# Altium schematic sheet led_board.SchDoc
size A
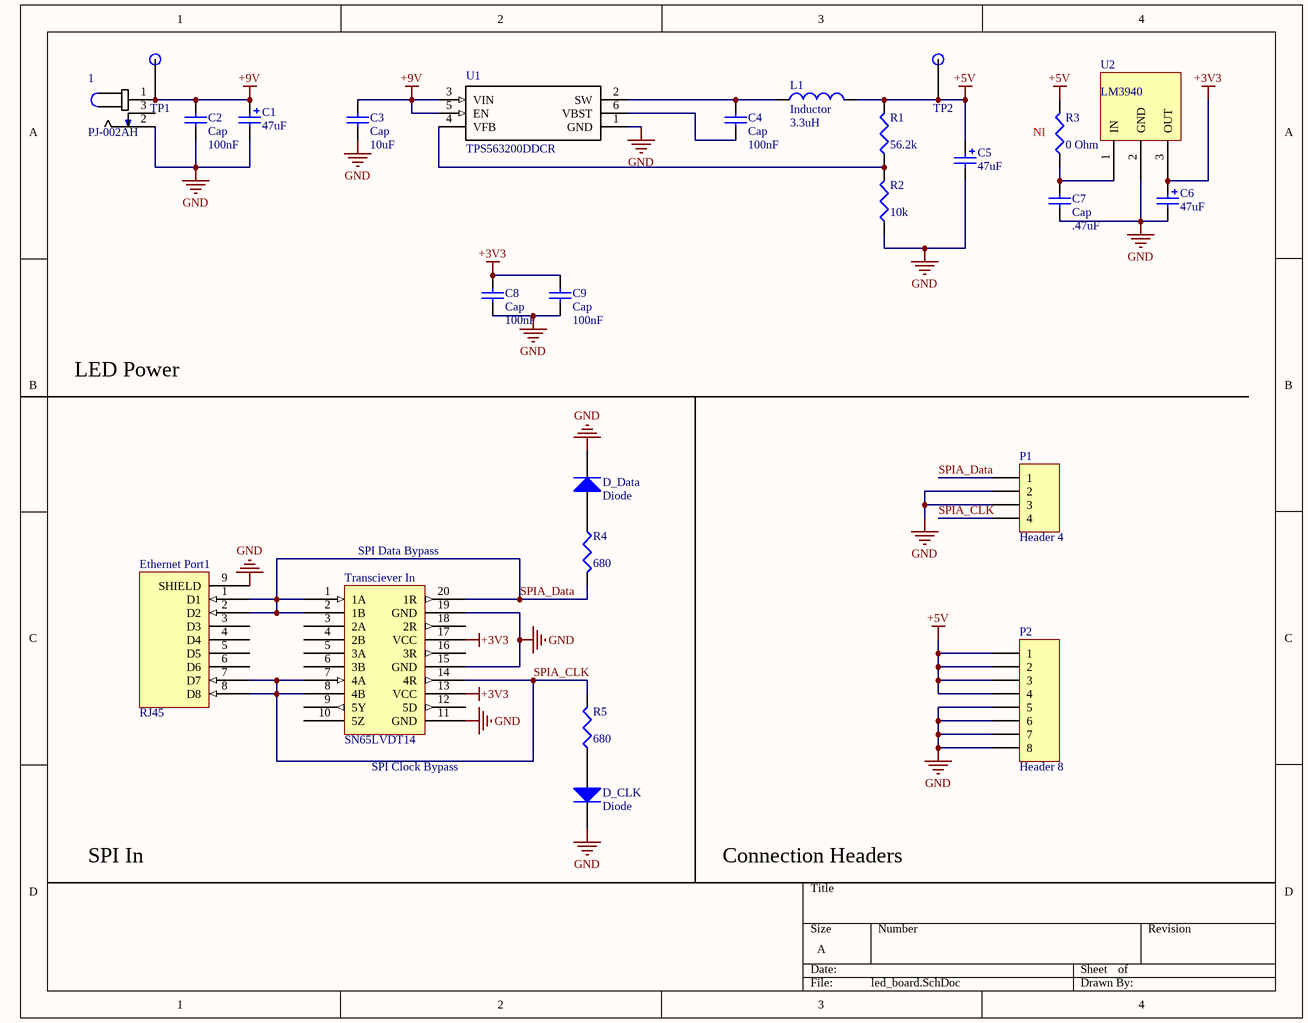
[diagram p0: led_board.SchDoc]

## Parts
1  PJ-002AH  [PJ-002AH]
C1  47uF  [Pol Cap 5mm-10mm]
C2  Cap  value 100nF  [HDR1X2]
C3  Cap  value 10uF  [HDR1X2]
C4  Cap  value 100nF  [HDR1X2]
C5  47uF  [HDR1X2]
C6  47uF  [HDR1X2]
C7  Cap  value .47uF  [HDR1X2]
C8  Cap  value 100nF  [HDR1X2]
C9  Cap  value 100nF  [HDR1X2]
D_CLK  Diode  [C1206]
D_Data  Diode  [C1206]
Ethernet_Port1  RJ45  [RJ45]
L1  Inductor  value 3.3uH  [RB5-10.5]
P1  Header 4  [HDR1X4]
P2  Header 8  [HDR1X8]
R1  value 56.2k  [RAD-0.2]
R2  value 10k  [RAD-0.2]
R3  value 0 Ohm  [HDR1X2]
R4  value 680  [RAD-0.2]
R5  value 680  [RAD-0.2]
TP1  Test Point  [Test Point]  (value not drawn)
TP2  Test Point  [Test Point]  (value not drawn)
Transciever_In  SN65LVDT14  [SN65LVDT41]
U1  TPS563200DDCR  [DDC0006A]
U2  LM3940  [LM3940]

## Nets
+3V3: C6.1 C8.1 C9.1 Transciever_In.13(VCC) Transciever_In.17(VCC) U2.3(OUT)
+5V: C5.1 L1.2 P2.1 P2.2 P2.3 P2.4 R1.2 R3.2 TP2.TP(Test_Point)
+9V: 1.1 C1.1 C2.2 C3.2 TP1.TP(Test_Point) U1.3(VIN) U1.5(EN)
GND: 1.2 C1.2 C2.1 C3.1 C5.2 C6.2 C7.1 C8.2 C9.2 D_CLK.2(K) D_Data.2(K) Ethernet_Port1.9(SHIELD) P1.2 P1.3 P2.5 P2.6 P2.7 P2.8 R2.1 Transciever_In.11(GND) Transciever_In.15(GND) Transciever_In.19(GND) U1.1(GND) U2.2(GND)
SPIA_CLK: Ethernet_Port1.7(D7) Ethernet_Port1.8(D8) P1.4 R5.2 Transciever_In.7(4A) Transciever_In.8(4B) Transciever_In.14(4R)
SPIA_Data: Ethernet_Port1.1(D1) Ethernet_Port1.2(D2) P1.1 R4.2 Transciever_In.1(1A) Transciever_In.2(1B) Transciever_In.20(1R)
NetC4_1: C4.1 U1.6(VBST)
NetC4_2: C4.2 L1.1 U1.2(SW)
NetC7_2: C7.2 R3.1 U2.1(IN)
NetD_CLK_1: D_CLK.1(A) R5.1
NetD_Data_1: D_Data.1(A) R4.1
NetR1_1: R1.1 R2.2 U1.4(VFB)

Not connected (* = marked no-connect by the designer): 1 3; Ethernet_Port1 3(D3) 4(D4) 5(D5) 6(D6); Transciever_In 3(2A) 4(2B) 5(3A) 6(3B) 9(5Y) 10(5Z) 12(5D) 16(3R) 18(2R)

## Notes on the sheet
- (near R3) NI
- LED Power
- (near Transciever_In) SPI Data Bypass
- (near Transciever_In) SPI Clock Bypass
- SPI In
- Connection Headers

## Library data of the parts
C1 C5 C6 = UUQ1C470MCL1GB
C2-C4 C7-C9 = Cap: Capacitor; Published: 8-Jun-2000; LatestRevisionDate: 17-Jul-2002; LatestRevisionNote: Re-released for DXP Platform.; PackageReference: RAD-0.3; Publisher: Altium Limited; PackageDescription: Radial Cap, Thru-Hole; 2 Leads; 0.3 in Pin Spacing
D_CLK D_Data = Diode: Default Diode; Published: 8-Jun-2000; LatestRevisionDate: 17-Jul-2002; LatestRevisionNote: Re-released for DXP Platform.; PackageVersion: Sep-1996; PackageReference: SMC; Publisher: Altium Limited; PackageDescription: DO-214-AB/SMC; 2 C-Bend Leads; Body 7.9 x 5.9 mm, inc. leads (LxW); Code_JEDEC: DO-214-AB
Ethernet_Port1 = RJ45: pin to pad: 9>SGND
L1 = Inductor: Code_IEC: 1005; Published: 8-Jun-2000; LatestRevisionDate: 29-May-2009; LatestRevisionNote: IPC-7351 Footprint Added.; PackageReference: 0402-A; Publisher: Altium Limited; PackageDescription: Chip Inductor; Code_JEITA: 0402
P1 = Header 4: Header, 4-Pin; LatestRevisionDate: 17-Jul-2002; LatestRevisionNote: Re-released for DXP Platform.; Publisher: Altium Limited
P2 = Header 8: Header, 8-Pin; LatestRevisionDate: 17-Jul-2002; LatestRevisionNote: Re-released for DXP Platform.; Publisher: Altium Limited
R1-R5 = Res3: Resistor; Published: 8-Jun-2000; LatestRevisionDate: 29-May-2009; LatestRevisionNote: IPC-7351 Footprint Added.; PackageReference: J1-0603; Publisher: Altium Limited; PackageDescription: Chip Resistor
U1 = TPS563200DDCR: 17 V Input, 3A Synchronous Step-Down Regulator in SOT-23 with Advanced Eco-mode? 6-SOT -40 to 85; MF: Texas Instruments; Digi-Key_Part_Number: 296-43663-1-ND; Digi-Key_Purchase_URL: https://www.digikey.com/product-detail/en/texas-instruments/TPS563200DDCR/296-43663-1-ND/5864733?utm_source=snapeda&utm_medium=aggregator&utm_campaign=symbol; Package: TSOT-23 Texas Instruments; MP: TPS563200DDCR; SnapEDA_Link: https://www.snapeda.com/parts/TPS563200DDCR/Texas%20Instruments/view-part/?ref=snap; Value: *
1 = PJ-002AH: Value: *